# Altium schematic sheet 447Power.SchDoc
size A
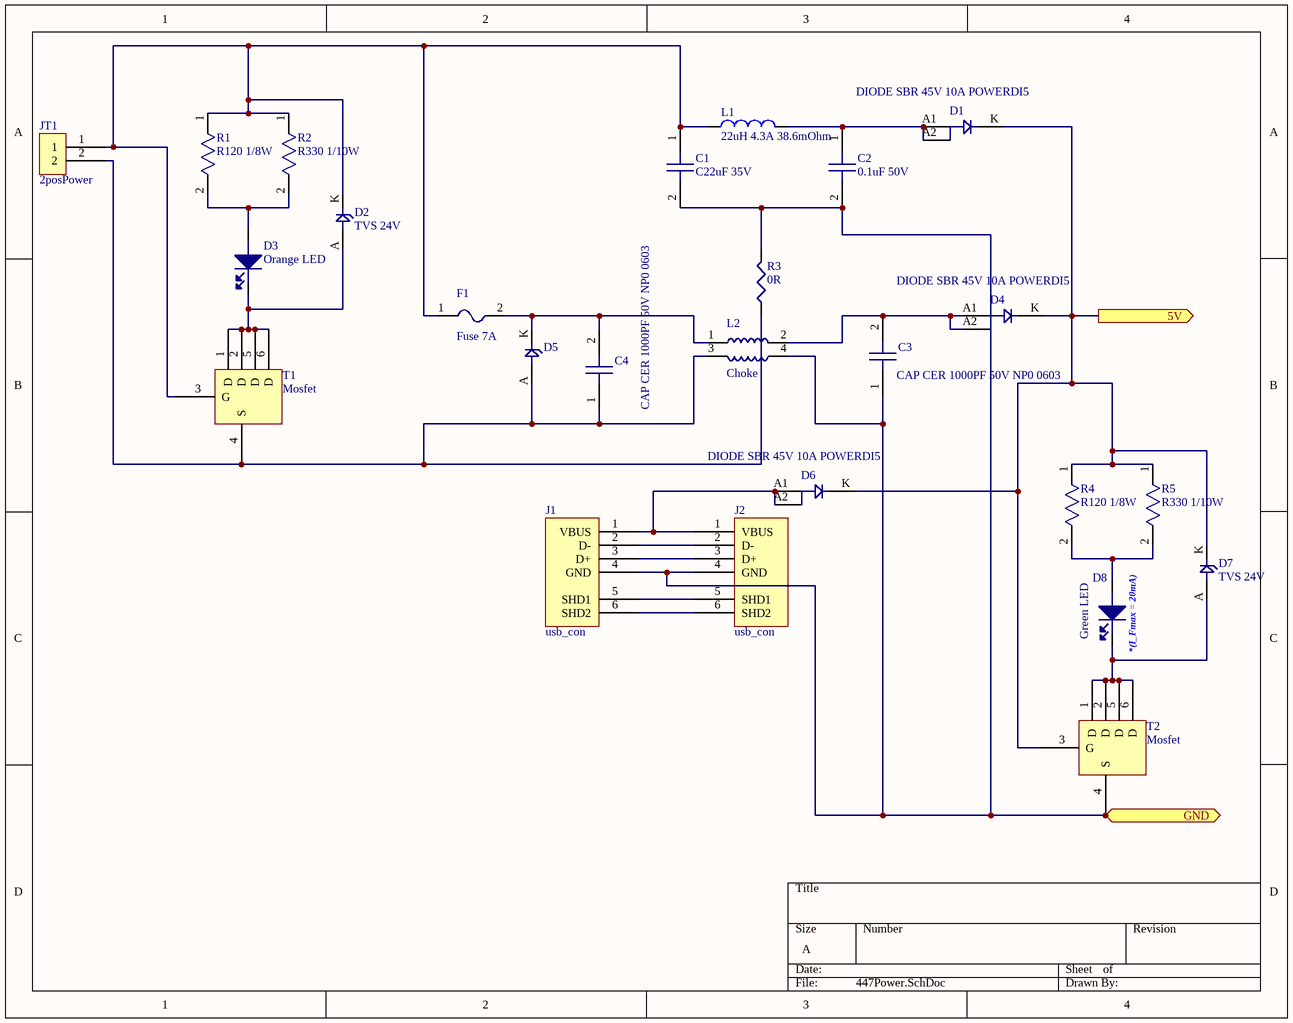
[diagram p0: 447Power.SchDoc]

## Parts
C1  C22uF 35V  [C0603]
C2  0.1uF 50V  [C0603]
C3  CAP CER 1000PF 50V NP0 0603  [C0603]
C4  CAP CER 1000PF 50V NP0 0603  [C0603]
D1  DIODE SBR 45V 10A POWERDI5  [Diode-Rect - 3D]
D2  TVS 24V  [DO219AB_3DBody]
D3  Orange LED  [LED_0603]
D4  DIODE SBR 45V 10A POWERDI5  [Diode-Rect - 3D]
D5  TVS DIODE 33VWM 53.3VC SMC  [SMC-TVS-33]  (value not drawn)
D6  DIODE SBR 45V 10A POWERDI5  [Diode-Rect - 3D]
D7  TVS 24V  [DO219AB_3DBody]
D8  Green LED  [LED_0603]
F1  Fuse 7A  [Fuse]
J1  usb_con  [USB_typeA]
J2  usb_con  [USB_typeA]
JT1  2posPower  [GI TE con]
L1  22uH 4.3A 38.6mOhm  [Inductor SRR1280A-220M - Original3D]
L2  Choke  [2744045447_SOJ254P850X305-4M]
R1  R120 1/8W  [R0805]
R2  R330 1/10W  [R0603]
R3  0R  [R0805]
R4  R120 1/8W  [R0805]
R5  R330 1/10W  [R0603]
T1  Mosfet  [SOIC6-super]
T2  Mosfet  [SOIC6-super]

## Ports
5V (out), GND

## Nets
5V: D1.K D4.K D6.K D7.K R4.1 R5.1 T2.3(G) ; port 5V
GND: C1.2 C2.2 C3.1 J1.4(GND) J2.4(GND) L2.4 R3.2 T2.4(S) ; port GND
NetC1_1: C1.1 D2.K F1.1 JT1.1 L1.1 R1.1 R2.1 T1.3(G)
NetC2_1: C2.1 D1.A1 D1.A2 L1.2
NetC3_2: C3.2 D4.A1 D4.A2 L2.2
NetC4_1: C4.1 D5.A JT1.2 L2.3 R3.1 T1.4(S)
NetC4_2: C4.2 D5.K F1.2 L2.1
NetD2_A: D2.A D3.1(Cathode) T1.1(D) T1.2(D) T1.5(D) T1.6(D)
NetD3_2: D3.2(Anode) R1.2 R2.2
NetD6_A1: D6.A1 D6.A2 J1.1(VBUS) J2.1(VBUS)
NetD7_A: D7.A D8.1(Cathode) T2.1(D) T2.2(D) T2.5(D) T2.6(D)
NetD8_2: D8.2(Anode) R4.2 R5.2
NetJ1_2: J1.2(D-) J2.2(D-)
NetJ1_3: J1.3(D+) J2.3(D+)
NetJ1_5: J1.5(SHD1) J2.5(SHD1)
NetJ1_6: J1.6(SHD2) J2.6(SHD2)

## Notes on the sheet
- (in symbol LG L29K-G2J1-24-Z) *(I_Fmax = 20mA)

## Library data of the parts
C1 = C3216X5R1V226M160AC: CAP CER 22UF 35V X5R 1206; Manufacturer: TDK Corporation; Tolerance: ±20%; Notification: Current market demand for these product types have resulted in fluctuating and extending lead times. Lead times may differ.; Supplier 1: Digi-Key; Manufacturer Part Number: C3216X5R1V226M160AC; RoHS: RoHS Compliant; Category: Capacitors; Stock 1: 22163; Pricing 1: 1=1.2, 10=0.949, 100=0.7116, 500=0.53762, 1000=0.47438 (USD); Packaging: Cut Tape (CT); Part Status: Active; Voltage - Rated: 35V; Temperature Coefficient: X5R; Operating Temperature: -55°C ~ 85°C; Features: Low ESL; Ratings: -; Applications: General Purpose; Failure Rate: -; Mounting Type: Surface Mount, MLCC; Package / Case: 1206 (3216 Metric); Size / Dimension: 0.126" L x 0.063" W (3.20mm x 1.60mm); Height - Seated (Max): -; Thickness (Max): 0.071" (1.80mm); Lead Spacing: -; Lead Style: -; ComponentLink1URL: https://product.tdk.com/info/en/catalog/datasheets/mlcc_commercial_general_en.pdf; ComponentLink1Description: https://product.tdk.com/info/en/catalog/datasheets/mlcc_commercial_general_en.pdf; Supplier Part Number 1: 445-8045-1-ND
C2 = CC0603KRX7R9BB104: CAP CER 0.1UF 50V X7R 0603; Manufacturer: Yageo; Capacitance: 0.10µF; Tolerance: ±10%; Supplier 1: Digi-Key; Manufacturer Part Number: CC0603KRX7R9BB104; RoHS: RoHS Compliant; Category: Capacitors; Stock 1: 1899628; Pricing 1: 1=0.1, 10=0.029, 25=0.0204, 100=0.0131, 250=0.01072, 500=0.00918, 1000=0.00715 (USD); Packaging: Cut Tape (CT); Voltage - Rated: 50V; Temperature Coefficient: X7R; Mounting Type: Surface Mount, MLCC; Operating Temperature: -55°C ~ 125°C; Applications: General Purpose; Ratings: -; Package / Case: 0603 (1608 Metric); Size / Dimension: 0.063" L x 0.031" W (1.60mm x 0.80mm); Height - Seated (Max): -; Thickness (Max): 0.035" (0.90mm); Lead Spacing: -; Features: -; Lead Style: -; ComponentLink1URL: http://www.yageo.com/documents/recent/UPY-GPHC_X7R_6.3V-to-50V_13.pdf; ComponentLink1Description: http://www.yageo.com/documents/recent/UPY-GPHC_X7R_6.3V-to-50V_13.pdf; Supplier Part Number 1: 311-1344-1-ND
C3 C4 = GRM1885C1H102FA01J: Manufacturer: Murata Electronics North America; Tolerance: ±1%; Temperature Coefficient: C0G, NP0; Supplier 1: Digi-Key; Manufacturer Part Number: GRM1885C1H102FA01J; RoHS: RoHS Compliant; Category: Capacitors; Stock 1: 63093; Pricing 1: 1=0.11, 10=0.075, 50=0.0432, 100=0.0356, 250=0.03, 500=0.02512, 1000=0.02063, 5000=0.01744 (USD); Packaging: Cut Tape (CT); Part Status: Active; Capacitance: 1000pF; Voltage - Rated: 50V; Mounting Type: Surface Mount, MLCC; Operating Temperature: -55°C ~ 125°C; Applications: General Purpose; Ratings: -; Package / Case: 0603 (1608 Metric); Size / Dimension: 0.063" L x 0.031" W (1.60mm x 0.80mm); Height - Seated (Max): -; Thickness (Max): 0.035" (0.90mm); Lead Spacing: -; Features: -; Lead Style: -; ComponentLink1URL: http://www.murata.com/~/media/webrenewal/support/library/catalog/products/capacitor/mlcc/c02e.pdf; ComponentLink1Description: http://www.murata.com/~/media/webrenewal/support/library/catalog/products/capacitor/mlcc/c02e.pdf; Supplier Part Number 1: 490-6377-1-ND
D1 D4 D6 = SBR10U45SP5-13: Manufacturer: Diodes Incorporated; Diode Type: Super Barrier; Voltage - Forward (Vf) (Max) @ If: 470mV @ 10A; Speed: Fast Recovery =< 500ns, > 200mA (Io); Current - Reverse Leakage @ Vr: 300µA @ 45V; Supplier 1: Digi-Key; Manufacturer Part Number: SBR10U45SP5-13; RoHS: RoHS Compliant; Category: Discrete Semiconductor Products; Stock 1: 14145; Pricing 1: 1=0.77, 10=0.68, 100=0.52, 500=0.412, 1000=0.33 (USD); Packaging: Cut Tape (CT); Part Status: Active; Voltage - DC Reverse (Vr) (Max): 45V; Current - Average Rectified (Io): 10A; Reverse Recovery Time (trr): -; Capacitance @ Vr, F: -; Mounting Type: Surface Mount; Package / Case: PowerDI™ 5; Supplier Device Package: PowerDI™ 5; Operating Temperature - Junction: -65°C ~ 150°C; ComponentLink1URL: http://www.diodes.com/_files/datasheets/SBR10U45SP5.pdf; ComponentLink1Description: http://www.diodes.com/_files/datasheets/SBR10U45SP5.pdf; Supplier Part Number 1: SBR10U45SP5-13DICT-ND
D2 D7 = SMF24A-E3-08: TVS DIODE 24VWM 38.9VC SMF; Manufacturer: Vishay Semiconductor Diodes Division; Type: Zener; Unidirectional Channels: 1; Voltage - Breakdown (Min): 26.7V; Voltage - Clamping (Max) @ Ipp: 38.9V; Current - Peak Pulse (10/1000µs): 5.1A; Power - Peak Pulse: 200W; Power Line Protection: No; Capacitance @ Frequency: 244pF @ 1MHz; Supplier 1: Digi-Key; Manufacturer Part Number: SMF24A-E3-08; RoHS: RoHS Compliant; Category: Circuit Protection; Stock 1: 185013; Pricing 1: 1=0.47, 10=0.346, 25=0.3028, 100=0.196, 250=0.16224, 500=0.12978, 1000=0.0995 (USD); Packaging: Cut Tape (CT); Bidirectional Channels: -; Voltage - Reverse Standoff (Typ): 24V; Applications: General Purpose; Operating Temperature: -65°C ~ 175°C (TJ); Mounting Type: Surface Mount; Package / Case: DO-219AB; Supplier Device Package: SMF; ComponentLink1URL: http://www.vishay.com/docs/85881/smf5v0atosmf58a.pdf; ComponentLink1Description: http://www.vishay.com/docs/85881/smf5v0atosmf58a.pdf; Supplier Part Number 1: SMF24A-E3-08CT-ND
D3 = LO L29K-H2K1-24-Z: LED ORANGE DIFFUSED 0603 SMD; Manufacturer: OSRAM Opto Semiconductors Inc.; Lens Color: White; Millicandela Rating: 6.3mcd; Lens Style/Size: Rectangle with Flat Top, 1.30mm x 0.80mm; Voltage - Forward (Vf) (Typ): 1.8V; Current - Test: 2mA; Viewing Angle: 160°; Wavelength - Dominant: 606nm; Wavelength - Peak: 610nm; Supplier 1: Digi-Key; Manufacturer Part Number: LO L29K-H2K1-24-Z; RoHS: RoHS Compliant; Category: Optoelectronics; Stock: 8950; Pricing 1: 1=0.51, 10=0.359, 25=0.3116, 100=0.2396, 250=0.19468, 500=0.14376, 1000=0.1198, 2500=0.10782 (USD); Packaging: Cut Tape (CT); Part Status: Active; Color: Orange; Lens Transparency: Diffused; Mounting Type: Surface Mount; Features: -; Package / Case: 0603 (1608 Metric); Supplier Device Package: 0603; Size / Dimension: 1.70mm L x 0.80mm W; Height (Max): 0.65mm; ComponentLink1URL: http://www.osram-os.com/Graphics/XPic0/00077105_0.pdf; ComponentLink1Description: http://www.osram-os.com/Graphics/XPic0/00077105_0.pdf; Supplier Part Number 1: 475-2740-1-ND
D5 = SMCJ33CA-13-F: Manufacturer: Diodes Incorporated; Type: Zener; Bidirectional Channels: 1; Voltage - Reverse Standoff (Typ): 33V; Voltage - Breakdown (Min): 36.7V; Voltage - Clamping (Max) @ Ipp: 53.3V; Current - Peak Pulse (10/1000µs): 28.1A; Power - Peak Pulse: 1500W (1.5kW); Power Line Protection: No; Supplier 1: Digi-Key; Manufacturer Part Number: SMCJ33CA-13-F; RoHS: RoHS Compliant; Category: Circuit Protection; Stock 1: 2718; Pricing 1: 1=1.43, 10=1.277, 100=0.9954, 500=0.8232, 1000=0.651 (USD); Packaging: Cut Tape (CT); Part Status: Active; Unidirectional Channels: -; Applications: General Purpose; Capacitance @ Frequency: -; Operating Temperature: -55°C ~ 150°C (TJ); Mounting Type: Surface Mount; Package / Case: DO-214AB, SMC; Supplier Device Package: SMC; ComponentLink1URL: http://www.diodes.com/_files/datasheets/ds19003.pdf; ComponentLink1Description: http://www.diodes.com/_files/datasheets/ds19003.pdf; Supplier Part Number 1: SMCJ33CA-FDICT-ND
D8 = LG L29K-G2J1-24-Z: LED GREEN DIFFUSED 0603 SMD; Manufacturer: OSRAM Opto Semiconductors Inc.; Lens Color: White; Millicandela Rating: 3.92mcd; Lens Style/Size: Rectangle with Flat Top, 1.30mm x 0.80mm; Voltage - Forward (Vf) (Typ): 1.7V; Current - Test: 2mA; Viewing Angle: 160°; Wavelength - Dominant: 570nm; Wavelength - Peak: 572nm; Supplier 1: Digi-Key; Manufacturer Part Number: LG L29K-G2J1-24-Z; RoHS: RoHS Compliant; Category: Optoelectronics; Stock: 0; Pricing 1: 1=0.47, 10=0.339, 25=0.2768, 100=0.2215, 250=0.18688, 500=0.15918, 1000=0.12458, 2500=0.1142 (USD); Packaging: Cut Tape (CT); Part Status: Active; Color: Green; Lens Transparency: Diffused; Mounting Type: Surface Mount; Features: -; Package / Case: 0603 (1608 Metric); Supplier Device Package: 0603; Size / Dimension: 1.70mm L x 0.80mm W; Height (Max): 0.65mm; ComponentLink1URL: http://www.osram-os.com/Graphics/XPic0/00167682_0.pdf; ComponentLink1Description: http://www.osram-os.com/Graphics/XPic0/00167682_0.pdf; Supplier Part Number 1: 475-2709-1-ND
F1 = C1F 7: FUSE 7.0A 125VAC FAST 1206; Manufacturer: Bel Fuse Inc.; Fuse Type: Board Mount (Cartridge Style Excluded); Voltage Rating - AC: 125V; Voltage Rating - DC: 63V; Breaking Capacity @ Rated Voltage: 35A AC, 50A DC; Approvals: CE, cURus; DC Cold Resistance: 0.012 Ohm; Supplier 1: Digi-Key; Manufacturer Part Number: C1F 7; RoHS: RoHS Compliant; Category: Circuit Protection; Stock 1: 8906; Pricing 1: 1=0.26, 5=0.254, 10=0.243, 50=0.217, 100=0.202, 250=0.17952, 500=0.1496, 1000=0.14212 (USD); Packaging: Cut Tape (CT); Part Status: Active; Current Rating: 7A; Response Time: Fast; Package / Case: 1206 (3216 Metric); Mounting Type: Surface Mount; Melting I²t: *; Operating Temperature: -55°C ~ 125°C; Color: -; Size / Dimension: 0.126" L x 0.062" W (3.20mm x 1.58mm); ComponentLink1URL: http://belfuse.com/pdfs/C1F.pdf; ComponentLink1Description: http://belfuse.com/pdfs/C1F.pdf; Supplier Part Number 1: 507-1888-1-ND
J1 J2 = UE27AC54100: CONN RCPT USB TYPE A R/A GOLD; Manufacturer: Amphenol Commercial Products; Connector Type: USB - A; Number of Contacts: 4; Gender: Receptacle; Specifications: USB 2.0; Supplier 1: Digi-Key; Manufacturer Part Number: UE27AC54100; RoHS: RoHS Compliant; Category: Connectors, Interconnects; Stock 1: 20642; Pricing 1: 1=0.4, 10=0.378, 25=0.3404, 50=0.3024, 100=0.2898, 250=0.2646, 500=0.252, 1000=0.2079, 2500=0.189 (USD); Packaging: Tray; Mounting Type: Through Hole, Right Angle, Horizontal; Features: Board Guide; Ingress Protection: -; ComponentLink1URL: https://www.amphenolcanada.com/ProductSearch/drawings/AC/UE27ACX4X0X.pdf; ComponentLink1Description: https://www.amphenolcanada.com/ProductSearch/drawings/AC/UE27ACX4X0X.pdf; Supplier Part Number 1: UE27AC54100-ND
JT1 = 2-2232876-1: GIC6.0MM CONNECTOR HEADER 2POS; Manufacturer: TE Connectivity AMP Connectors; Connector Type: Header, Shrouded; Number of Positions: 2; Number of Positions Loaded: All; Pitch: 0.236" (6.00mm); Supplier 1: Digi-Key; Manufacturer Part Number: 2-2232876-1; RoHS: RoHS Compliant; Category: Connectors, Interconnects; Stock 1: 2796; Pricing 1: 1=0.51, 10=0.482, 25=0.4132, 50=0.3512, 100=0.3373, 250=0.30292, 500=0.28914, 1000=0.24095, 2500=0.2203 (USD); Packaging: Bulk; Part Status: Active; Contact Type: Male Pin; Number of Rows: 1; Row Spacing: -; Contact Mating Length: -; Mounting Type: Through Hole; Termination: Kinked Pin, Solder; Fastening Type: Latch Holder; Features: Board Guide; Contact Finish: Tin; Contact Finish Thickness: 31.5µin (0.80µm); Color: Natural; ComponentLink1URL: http://www.te.com/commerce/DocumentDelivery/DDEController?Action=srchrtrv&DocNm=2232876&DocType=Customer+Drawing&DocLang=English; ComponentLink1Description: http://www.te.com/commerce/DocumentDelivery/DDEController?Action=srchrtrv&DocNm=2232876&DocType=Customer+Drawing&DocLang=English; Supplier Part Number 1: A123805-ND
L1 = SRR1280A-220M: FIXED IND 22UH 4.3A 38.6 mOHM; Manufacturer: Bourns Inc.; Material - Core: Ferrite; Tolerance: ±20%; Shielding: Shielded; DC Resistance (DCR): 38.6 mOhm Max; Q @ Freq: 20 @ 2.52MHz; Supplier 1: Digi-Key; Manufacturer Part Number: SRR1280A-220M; RoHS: RoHS Compliant; Category: Inductors, Coils, Chokes; Stock 1: 2460; Pricing 1: 1=1.3, 10=1.211, 100=0.8756 (USD); Packaging: Cut Tape (CT); Part Status: Active; Type: -; Ratings: AEC-Q200; Operating Temperature: -40°C ~ 125°C; Mounting Type: Surface Mount; Package / Case: Nonstandard; Supplier Device Package: 1280; Size / Dimension: 0.492" L x 0.492" W (12.50mm x 12.50mm); Height - Seated (Max): 0.315" (8.00mm); ComponentLink1URL: http://www.bourns.com/docs/Product-Datasheets/SRR1280A.pdf; ComponentLink1Description: http://www.bourns.com/docs/Product-Datasheets/SRR1280A.pdf; Supplier Part Number 1: SRR1280A-220MCT-ND
L2 = 2744045447: FAIR-RITE - 2744045447 - FERRITE BEAD, 1400UOHM, 5A; Impedance @ 100MHz: 60; DC Current Rating: 5; DC Resistance Max: 1400; SVHC: No SVHC (17-Dec-2015); External Diameter: 2.85; Ferrite Mounting: SMD; Resistance: 1.2mohm<!--FANDB--><div class="features-and-benefits-container"><div class="features-and-benefits-description"><span class="features-benefits-value">The 2744045447 is a SM Bead provides a common magnetic path for the flux generated by the current to the load and the return current from the load. The current compensation results in zero magnetic flux in the bead. Wires are oxygen free high conductivity copper with 100% matte tin plating over a nickel undercoating. This SM bead meets the solderability specifications when tested in accordance with MIL-STD-202, method 208. After dipping the mounting site of the bead, the solder surface shall be at least 95% covered with a smooth solder coating. The edges of the copper strip are not specified as solderable surfaces. SM bead is controlled for impedance limits only and suitable for use with board components.</span></div><div class="features-and-benefits-list"><ul class="features-and-benefits-list-list"><li class="features-and-benefits-list-item">Supports broadband frequencies (10 to 300MHz)</li><li class="features-and-benefits-list-item">-55 to 125; Supplier 1: Farnell; Manufacturer: FAIR-RITE; Manufacturer Part Number: 2744045447; RoHS: YES; Stock 1: 13; Pricing 1: 1=0,731, 50=0,477, 100=0,417, 250=0,278, 500=0,261, 1000=0,244, 5000=0,209, 10000=0,182 (EUR); Ferrite Case Style: -; Impedance Tolerance: -; Product Range: -; Automotive Qualification Standards: -; Packaging: Cut Tape; ComponentLink1URL: http://www.farnell.com/datasheets/26138.pdf; ComponentLink1Description: http://www.farnell.com/datasheets/26138.pdf; Supplier Part Number 1: 1463463
R1 R4 = RC0805FR-07120RL: RES SMD 120 OHM 1% 1/8W 0805; Manufacturer: Yageo; Resistance (Ohms): 120; Power (Watts): 0.125W, 1/8W; Temperature Coefficient: ±100ppm/°C; Supplier 1: Digi-Key; Manufacturer Part Number: RC0805FR-07120RL; RoHS: RoHS Compliant; Category: Resistors; Stock 1: 99092; Pricing 1: 1=0.1, 10=0.021, 25=0.0152, 100=0.0084, 250=0.00644, 500=0.00514, 1000=0.00379, 2500=0.00329 (USD); Packaging: Cut Tape (CT); Tolerance: ±1%; Composition: Thick Film; Features: Moisture Resistant; Operating Temperature: -55°C ~ 155°C; Package / Case: 0805 (2012 Metric); Supplier Device Package: 0805; Size / Dimension: 0.079" L x 0.049" W (2.00mm x 1.25mm); Height: 0.024" (0.60mm); Number of Terminations: 2; ComponentLink1URL: http://www.yageo.com/documents/recent/PYu-RC_Group_51_RoHS_L_04.pdf; ComponentLink1Description: http://www.yageo.com/documents/recent/PYu-RC_Group_51_RoHS_L_04.pdf; Supplier Part Number 1: 311-120CRCT-ND
R2 R5 = RC0603FR-07330RL: RES SMD 330 OHM 1% 1/10W 0603; Manufacturer: Yageo; Resistance (Ohms): 330; Power (Watts): 0.1W, 1/10W; Temperature Coefficient: ±100ppm/°C; Supplier 1: Digi-Key; Manufacturer Part Number: RC0603FR-07330RL; RoHS: RoHS Compliant; Category: Resistors; Stock 1: 271405; Pricing 1: 1=0.1, 10=0.014, 25=0.01, 100=0.0057, 250=0.00436, 500=0.00348, 1000=0.00257, 2500=0.00223 (USD); Packaging: Cut Tape (CT); Tolerance: ±1%; Composition: Thick Film; Features: Moisture Resistant; Operating Temperature: -55°C ~ 155°C; Package / Case: 0603 (1608 Metric); Supplier Device Package: 0603; Size / Dimension: 0.063" L x 0.031" W (1.60mm x 0.80mm); Height: 0.022" (0.55mm); Number of Terminations: 2; ComponentLink1URL: http://www.yageo.com/documents/recent/PYu-RC_Group_51_RoHS_L_04.pdf; ComponentLink1Description: http://www.yageo.com/documents/recent/PYu-RC_Group_51_RoHS_L_04.pdf; Supplier Part Number 1: 311-330HRCT-ND
R3 = RC0805JR-070RL_1: RES SMD 0.0 OHM JUMPER 1/8W 0805; Manufacturer: Yageo; Resistance (Ohms): 0.0; Power (Watts): 0.125W, 1/8W; Supplier 1: Digi-Key; Manufacturer Part Number: RC0805JR-070RL; RoHS: RoHS Compliant; Category: Resistors; Stock: 3988911; Pricing 1: 1=0.1, 10=0.018, 25=0.0128, 50=0.0098, 100=0.0072, 250=0.00548, 500=0.0044, 1000=0.00323 (USD); Packaging: Cut Tape (CT); Part Status: Active; Tolerance: Jumper; Composition: Thick Film; Features: Moisture Resistant; Temperature Coefficient: -; Operating Temperature: -55°C ~ 155°C; Package / Case: 0805 (2012 Metric); Supplier Device Package: 0805; Size / Dimension: 0.079" L x 0.049" W (2.00mm x 1.25mm); Height - Seated (Max): 0.024" (0.60mm); Failure Rate: -; ComponentLink1URL: http://www.yageo.com/documents/recent/PYu-RC_Group_51_RoHS_L_7.pdf; ComponentLink1Description: http://www.yageo.com/documents/recent/PYu-RC_Group_51_RoHS_L_7.pdf; Supplier Part Number 1: 311-0.0ARCT-ND
T1 T2 = FDC8884: MOSFET N-CH 30V 6.5A 6-SSOT; Manufacturer: Fairchild Semiconductor; FET Type: MOSFET N-Channel, Metal Oxide; FET Feature: Standard; Current - Continuous Drain (Id) @ 25°C: 6.5A (Ta), 8A (Tc); Rds On (Max) @ Id, Vgs: 23 mOhm @ 6.5A, 10V; Vgs(th) (Max) @ Id: 3V @ 250µA; Gate Charge (Qg) @ Vgs: 7.4nC @ 10V; Input Capacitance (Ciss) @ Vds: 465pF @ 15V; Power - Max: 800mW; Supplier 1: Digi-Key; Manufacturer Part Number: FDC8884; RoHS: RoHS Compliant; Category: Discrete Semiconductor Products; Stock 1: 15566; Pricing 1: 1=0.45, 10=0.387, 100=0.289, 500=0.227, 1000=0.175 (USD); Packaging: Cut Tape (CT); Part Status: Active; Drain to Source Voltage (Vdss): 30V; Operating Temperature: -55°C ~ 150°C (TJ); Mounting Type: Surface Mount; Package / Case: SOT-23-6 Thin, TSOT-23-6; Supplier Device Package: 6-SSOT; ComponentLink1URL: http://www.fairchildsemi.com/datasheets/FD/FDC8884.pdf; ComponentLink1Description: http://www.fairchildsemi.com/datasheets/FD/FDC8884.pdf; Supplier Part Number 1: FDC8884CT-ND